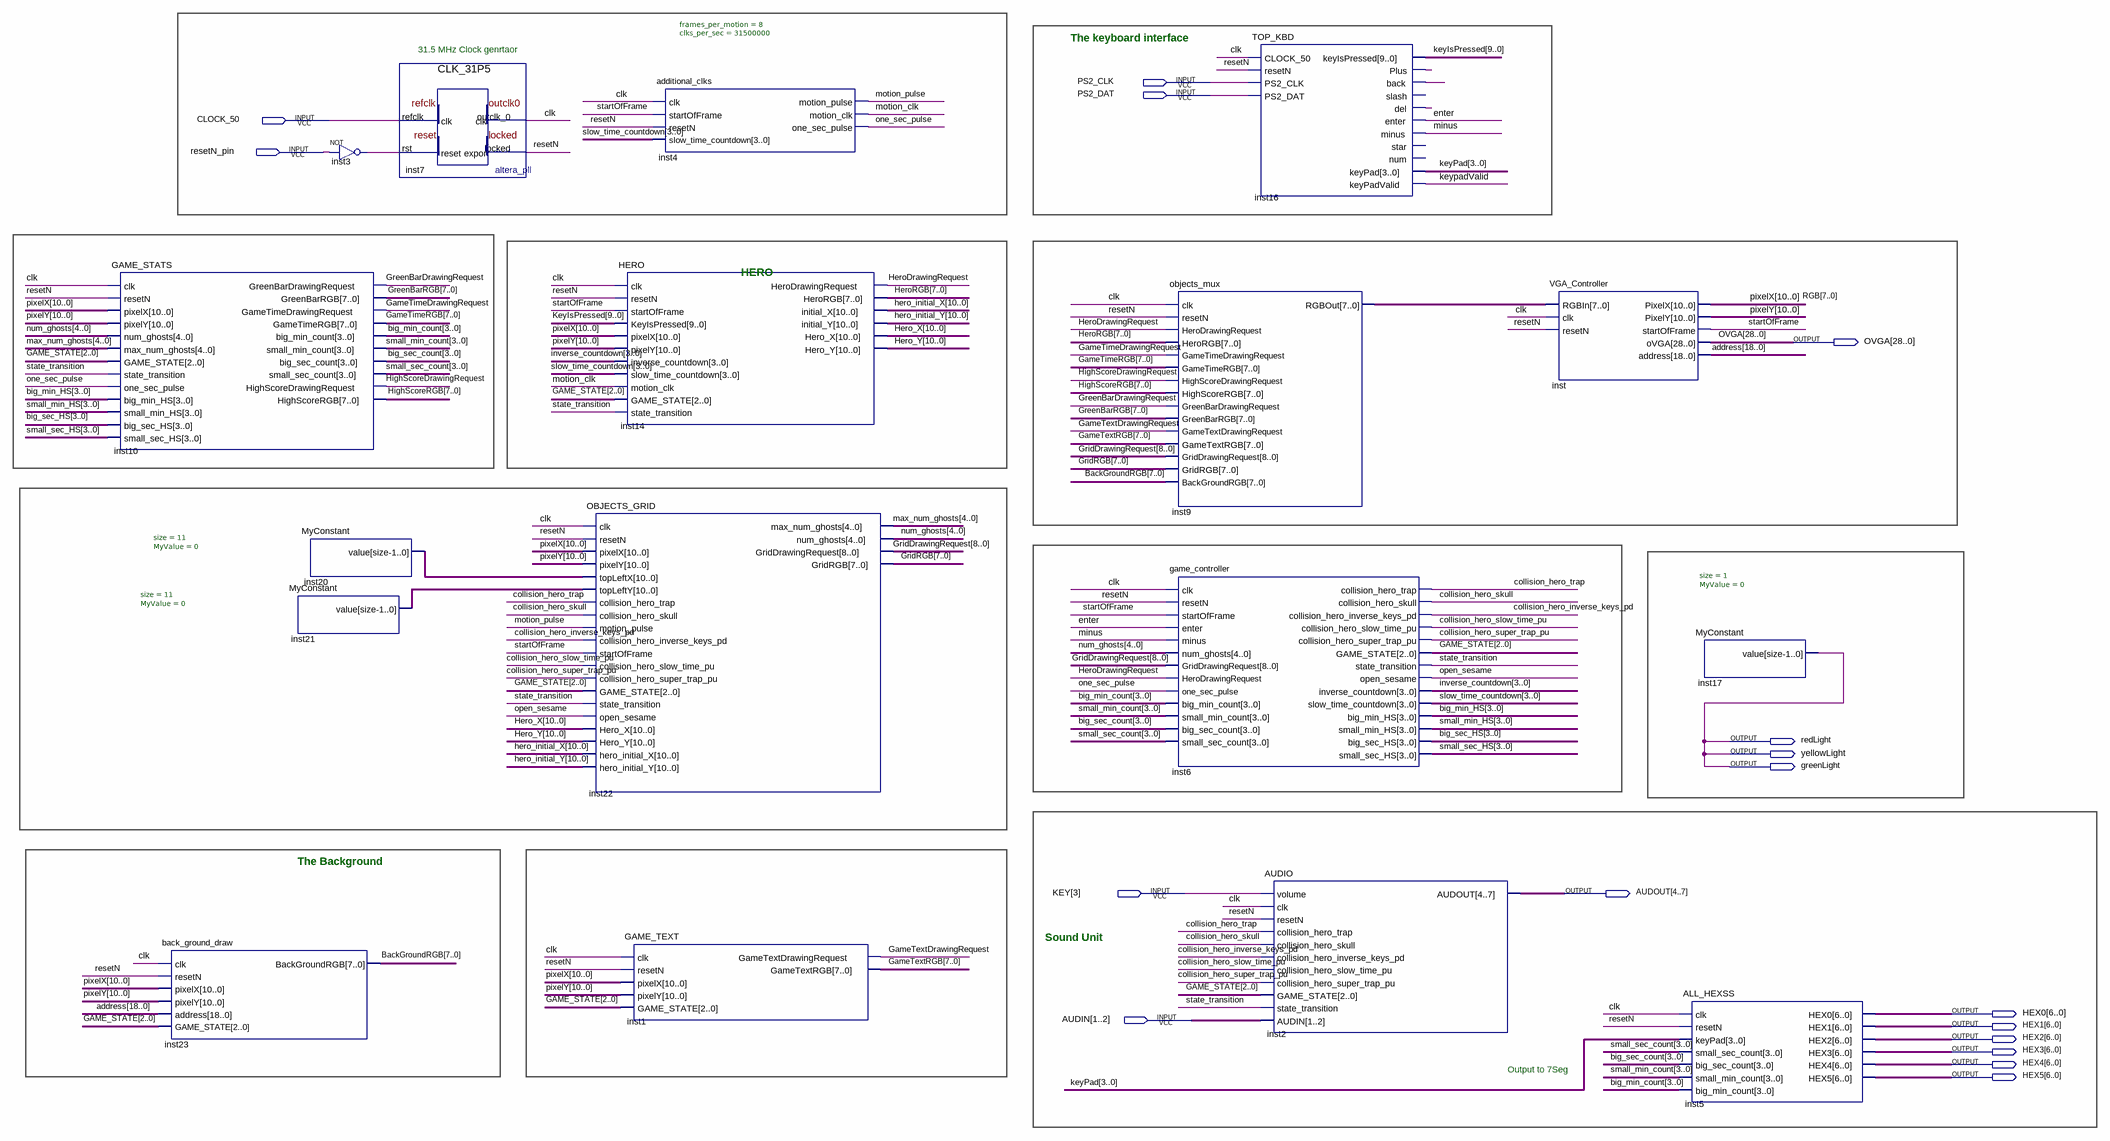
[diagram p0: schematic sheet]
// Quartus schematic TOP_GAME.bdf as structural Verilog: 17 symbols, 17 pins
module TOP_GAME (
  input  PS2_CLK,
  input  PS2_DAT,
  input  CLOCK_50,
  input  resetN_pin,
  input  [3:3] KEY,
  input  [1:2] AUDIN,
  output [28:0] OVGA,
  output redLight,
  output yellowLight,
  output greenLight,
  output [4:7] AUDOUT,
  output [6:0] HEX0,
  output [6:0] HEX1,
  output [6:0] HEX2,
  output [6:0] HEX3,
  output [6:0] HEX4,
  output [6:0] HEX5
);

  wire clk, collision_hero_inverse_keys_pd, collision_hero_skull, collision_hero_slow_time_pu,
       collision_hero_super_trap_pu, collision_hero_trap, enter, GameTextDrawingRequest,
       GameTimeDrawingRequest, GreenBarDrawingRequest, HeroDrawingRequest, HighScoreDrawingRequest,
       inst3_out, inst16_back, inst16_del, inst16_plus, keypadValid, minus, motion_clk, motion_pulse,
       one_sec_pulse, open_sesame, resetN, startOfFrame, state_transition;
  wire [2:0] GAME_STATE;
  wire [3:0] big_min_count, big_min_HS, big_sec_count, big_sec_HS, inverse_countdown, keyPad,
       slow_time_countdown, small_min_count, small_min_HS, small_sec_count, small_sec_HS;
  wire [4:0] max_num_ghosts, num_ghosts;
  wire [7:0] BackGroundRGB, GameTextRGB, GameTimeRGB, GreenBarRGB, GridRGB, HeroRGB, HighScoreRGB, RGB;
  wire [8:0] GridDrawingRequest;
  wire [9:0] KeyIsPressed;
  wire [10:0] hero_initial_X, hero_initial_Y, Hero_X, Hero_Y, inst20_value, inst21_value, pixelX, pixelY;
  wire [18:0] address;

  GAME_STATS inst10 (
    .clk(clk), .resetN(resetN), .pixelX(pixelX), .pixelY(pixelY), .num_ghosts(num_ghosts),
    .max_num_ghosts(max_num_ghosts), .GAME_STATE(GAME_STATE), .state_transition(state_transition),
    .one_sec_pulse(one_sec_pulse), .big_min_HS(big_min_HS), .small_min_HS(small_min_HS),
    .big_sec_HS(big_sec_HS), .small_sec_HS(small_sec_HS), .GreenBarDrawingRequest(GreenBarDrawingRequest),
    .GreenBarRGB(GreenBarRGB), .GameTimeDrawingRequest(GameTimeDrawingRequest), .GameTimeRGB(GameTimeRGB),
    .big_min_count(big_min_count), .small_min_count(small_min_count), .big_sec_count(big_sec_count),
    .small_sec_count(small_sec_count), .HighScoreDrawingRequest(HighScoreDrawingRequest),
    .HighScoreRGB(HighScoreRGB));
  back_ground_draw inst23 (
    .clk(clk), .resetN(resetN), .pixelX(pixelX), .pixelY(pixelY), .address(address), .GAME_STATE(GAME_STATE),
    .BackGroundRGB(BackGroundRGB));
  MyConstant #(.size(11), .MyValue(0)) inst20 (.value(inst20_value));
  MyConstant #(.size(11), .MyValue(0)) inst21 (.value(inst21_value));
  not inst3 (inst3_out, resetN_pin);
  CLK_31P5 inst7 (.refclk(CLOCK_50), .rst(inst3_out), .outclk_0(clk), .locked(resetN));
  HERO inst14 (
    .clk(clk), .resetN(resetN), .startOfFrame(startOfFrame), .KeyIsPressed(KeyIsPressed), .pixelX(pixelX),
    .pixelY(pixelY), .inverse_countdown(inverse_countdown), .slow_time_countdown(slow_time_countdown),
    .motion_clk(motion_clk), .GAME_STATE(GAME_STATE), .state_transition(state_transition),
    .HeroDrawingRequest(HeroDrawingRequest), .HeroRGB(HeroRGB), .initial_X(hero_initial_X),
    .initial_Y(hero_initial_Y), .Hero_X(Hero_X), .Hero_Y(Hero_Y));
  OBJECTS_GRID inst22 (
    .clk(clk), .resetN(resetN), .pixelX(pixelX), .pixelY(pixelY), .topLeftX(inst20_value),
    .topLeftY(inst21_value), .collision_hero_trap(collision_hero_trap),
    .collision_hero_skull(collision_hero_skull), .motion_pulse(motion_pulse),
    .collision_hero_inverse_keys_pd(collision_hero_inverse_keys_pd), .startOfFrame(startOfFrame),
    .collision_hero_slow_time_pu(collision_hero_slow_time_pu),
    .collision_hero_super_trap_pu(collision_hero_super_trap_pu), .GAME_STATE(GAME_STATE),
    .state_transition(state_transition), .open_sesame(open_sesame), .Hero_X(Hero_X), .Hero_Y(Hero_Y),
    .hero_initial_X(hero_initial_X), .hero_initial_Y(hero_initial_Y), .max_num_ghosts(max_num_ghosts),
    .num_ghosts(num_ghosts), .GridDrawingRequest(GridDrawingRequest), .GridRGB(GridRGB));
  GAME_TEXT inst1 (
    .clk(clk), .resetN(resetN), .pixelX(pixelX), .pixelY(pixelY), .GAME_STATE(GAME_STATE),
    .GameTextDrawingRequest(GameTextDrawingRequest), .GameTextRGB(GameTextRGB));
  additional_clks #(.frames_per_motion(8), .clks_per_sec(31500000)) inst4 (
    .clk(clk), .startOfFrame(startOfFrame), .resetN(resetN), .slow_time_countdown(slow_time_countdown),
    .motion_pulse(motion_pulse), .motion_clk(motion_clk), .one_sec_pulse(one_sec_pulse));
  objects_mux inst9 (
    .clk(clk), .resetN(resetN), .HeroDrawingRequest(HeroDrawingRequest), .HeroRGB(HeroRGB),
    .GameTimeDrawingRequest(GameTimeDrawingRequest), .GameTimeRGB(GameTimeRGB),
    .HighScoreDrawingRequest(HighScoreDrawingRequest), .HighScoreRGB(HighScoreRGB),
    .GreenBarDrawingRequest(GreenBarDrawingRequest), .GreenBarRGB(GreenBarRGB),
    .GameTextDrawingRequest(GameTextDrawingRequest), .GameTextRGB(GameTextRGB),
    .GridDrawingRequest(GridDrawingRequest), .GridRGB(GridRGB), .BackGroundRGB(BackGroundRGB), .RGBOut(RGB));
  game_controller inst6 (
    .clk(clk), .resetN(resetN), .startOfFrame(startOfFrame), .enter(enter), .minus(minus),
    .num_ghosts(num_ghosts), .GridDrawingRequest(GridDrawingRequest),
    .HeroDrawingRequest(HeroDrawingRequest), .one_sec_pulse(one_sec_pulse), .big_min_count(big_min_count),
    .small_min_count(small_min_count), .big_sec_count(big_sec_count), .small_sec_count(small_sec_count),
    .collision_hero_trap(collision_hero_trap), .collision_hero_skull(collision_hero_skull),
    .collision_hero_inverse_keys_pd(collision_hero_inverse_keys_pd),
    .collision_hero_slow_time_pu(collision_hero_slow_time_pu),
    .collision_hero_super_trap_pu(collision_hero_super_trap_pu), .GAME_STATE(GAME_STATE),
    .state_transition(state_transition), .open_sesame(open_sesame), .inverse_countdown(inverse_countdown),
    .slow_time_countdown(slow_time_countdown), .big_min_HS(big_min_HS), .small_min_HS(small_min_HS),
    .big_sec_HS(big_sec_HS), .small_sec_HS(small_sec_HS));
  TOP_KBD inst16 (
    .CLOCK_50(clk), .resetN(resetN), .PS2_CLK(PS2_CLK), .PS2_DAT(PS2_DAT), .keyIsPressed(KeyIsPressed),
    .Plus(inst16_plus), .back(inst16_back), .del(inst16_del), .enter(enter), .minus(minus), .keyPad(keyPad),
    .keyPadValid(keypadValid));  // open: slash, star, num
  AUDIO inst2 (
    .volume(KEY[3]), .clk(clk), .resetN(resetN), .collision_hero_trap(collision_hero_trap),
    .collision_hero_skull(collision_hero_skull),
    .collision_hero_inverse_keys_pd(collision_hero_inverse_keys_pd),
    .collision_hero_slow_time_pu(collision_hero_slow_time_pu),
    .collision_hero_super_trap_pu(collision_hero_super_trap_pu), .GAME_STATE(GAME_STATE),
    .state_transition(state_transition), .AUDIN(AUDIN), .AUDOUT(AUDOUT));
  VGA_Controller inst (
    .RGBIn(RGB), .clk(clk), .resetN(resetN), .PixelX(pixelX), .PixelY(pixelY), .startOfFrame(startOfFrame),
    .oVGA(OVGA), .address(address));
  MyConstant #(.size(1), .MyValue(0)) inst17 (.value(greenLight));
  ALL_HEXSS inst5 (
    .clk(clk), .resetN(resetN), .keyPad(keyPad), .small_sec_count(small_sec_count),
    .big_sec_count(big_sec_count), .small_min_count(small_min_count), .big_min_count(big_min_count),
    .HEX0(HEX0), .HEX1(HEX1), .HEX2(HEX2), .HEX3(HEX3), .HEX4(HEX4), .HEX5(HEX5));

  assign redLight = greenLight;
  assign yellowLight = greenLight;

  // Notes on the sheet:
  //   The keyboard interface
  //   31.5 MHz Clock genrtaor
  //   HERO
  //   The Background
  //   Sound Unit
  //   Output to 7Seg
endmodule
